# Altium schematic sheet NeopixelArray.SchDoc: Neopixel array
size A4
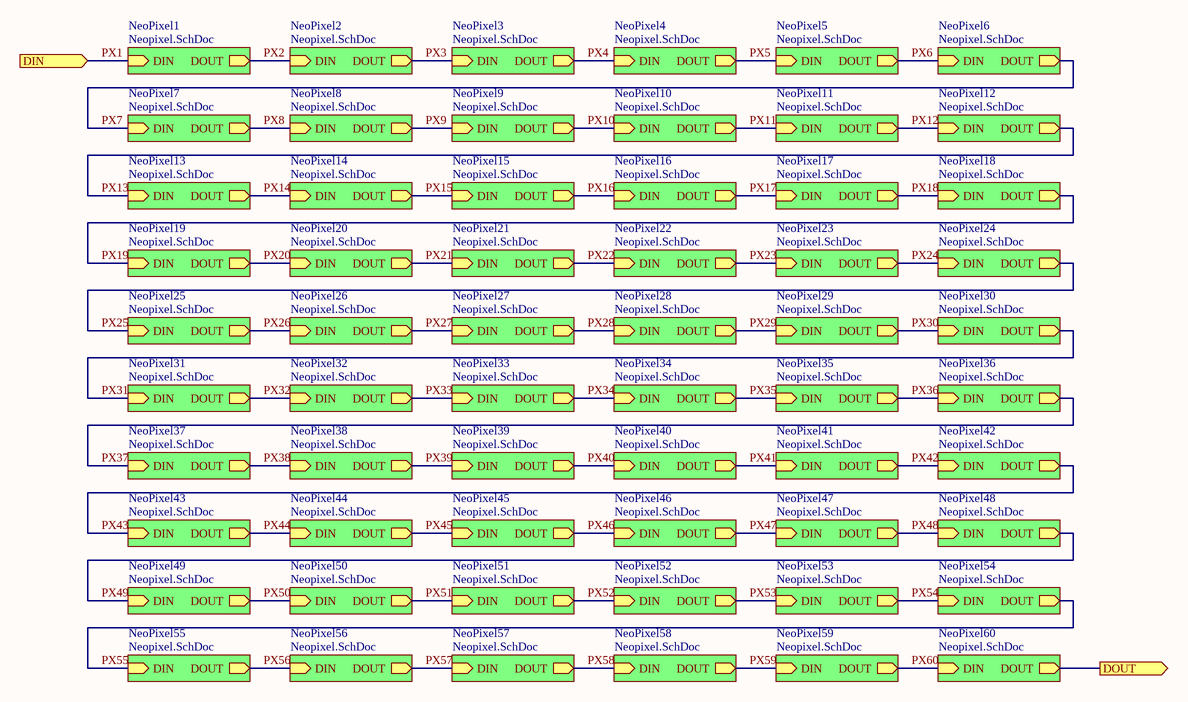
[diagram p0: NeopixelArray.SchDoc]

## Sub-sheets
NeoPixel1 = Neopixel.SchDoc: DIN (in), DOUT (out)
NeoPixel2 = Neopixel.SchDoc: DIN (in), DOUT (out)
NeoPixel3 = Neopixel.SchDoc: DIN (in), DOUT (out)
NeoPixel4 = Neopixel.SchDoc: DIN (in), DOUT (out)
NeoPixel5 = Neopixel.SchDoc: DIN (in), DOUT (out)
NeoPixel6 = Neopixel.SchDoc: DIN (in), DOUT (out)
NeoPixel7 = Neopixel.SchDoc: DIN (in), DOUT (out)
NeoPixel8 = Neopixel.SchDoc: DIN (in), DOUT (out)
NeoPixel9 = Neopixel.SchDoc: DIN (in), DOUT (out)
NeoPixel10 = Neopixel.SchDoc: DIN (in), DOUT (out)
NeoPixel11 = Neopixel.SchDoc: DIN (in), DOUT (out)
NeoPixel12 = Neopixel.SchDoc: DIN (in), DOUT (out)
NeoPixel13 = Neopixel.SchDoc: DIN (in), DOUT (out)
NeoPixel14 = Neopixel.SchDoc: DIN (in), DOUT (out)
NeoPixel15 = Neopixel.SchDoc: DIN (in), DOUT (out)
NeoPixel16 = Neopixel.SchDoc: DIN (in), DOUT (out)
NeoPixel17 = Neopixel.SchDoc: DIN (in), DOUT (out)
NeoPixel18 = Neopixel.SchDoc: DIN (in), DOUT (out)
NeoPixel19 = Neopixel.SchDoc: DIN (in), DOUT (out)
NeoPixel20 = Neopixel.SchDoc: DIN (in), DOUT (out)
NeoPixel21 = Neopixel.SchDoc: DIN (in), DOUT (out)
NeoPixel22 = Neopixel.SchDoc: DIN (in), DOUT (out)
NeoPixel23 = Neopixel.SchDoc: DIN (in), DOUT (out)
NeoPixel24 = Neopixel.SchDoc: DIN (in), DOUT (out)
NeoPixel25 = Neopixel.SchDoc: DIN (in), DOUT (out)
NeoPixel26 = Neopixel.SchDoc: DIN (in), DOUT (out)
NeoPixel27 = Neopixel.SchDoc: DIN (in), DOUT (out)
NeoPixel28 = Neopixel.SchDoc: DIN (in), DOUT (out)
NeoPixel29 = Neopixel.SchDoc: DIN (in), DOUT (out)
NeoPixel30 = Neopixel.SchDoc: DIN (in), DOUT (out)
NeoPixel31 = Neopixel.SchDoc: DIN (in), DOUT (out)
NeoPixel32 = Neopixel.SchDoc: DIN (in), DOUT (out)
NeoPixel33 = Neopixel.SchDoc: DIN (in), DOUT (out)
NeoPixel34 = Neopixel.SchDoc: DIN (in), DOUT (out)
NeoPixel35 = Neopixel.SchDoc: DIN (in), DOUT (out)
NeoPixel36 = Neopixel.SchDoc: DIN (in), DOUT (out)
NeoPixel37 = Neopixel.SchDoc: DIN (in), DOUT (out)
NeoPixel38 = Neopixel.SchDoc: DIN (in), DOUT (out)
NeoPixel39 = Neopixel.SchDoc: DIN (in), DOUT (out)
NeoPixel40 = Neopixel.SchDoc: DIN (in), DOUT (out)
NeoPixel41 = Neopixel.SchDoc: DIN (in), DOUT (out)
NeoPixel42 = Neopixel.SchDoc: DIN (in), DOUT (out)
NeoPixel43 = Neopixel.SchDoc: DIN (in), DOUT (out)
NeoPixel44 = Neopixel.SchDoc: DIN (in), DOUT (out)
NeoPixel45 = Neopixel.SchDoc: DIN (in), DOUT (out)
NeoPixel46 = Neopixel.SchDoc: DIN (in), DOUT (out)
NeoPixel47 = Neopixel.SchDoc: DIN (in), DOUT (out)
NeoPixel48 = Neopixel.SchDoc: DIN (in), DOUT (out)
NeoPixel49 = Neopixel.SchDoc: DIN (in), DOUT (out)
NeoPixel50 = Neopixel.SchDoc: DIN (in), DOUT (out)
NeoPixel51 = Neopixel.SchDoc: DIN (in), DOUT (out)
NeoPixel52 = Neopixel.SchDoc: DIN (in), DOUT (out)
NeoPixel53 = Neopixel.SchDoc: DIN (in), DOUT (out)
NeoPixel54 = Neopixel.SchDoc: DIN (in), DOUT (out)
NeoPixel55 = Neopixel.SchDoc: DIN (in), DOUT (out)
NeoPixel56 = Neopixel.SchDoc: DIN (in), DOUT (out)
NeoPixel57 = Neopixel.SchDoc: DIN (in), DOUT (out)
NeoPixel58 = Neopixel.SchDoc: DIN (in), DOUT (out)
NeoPixel59 = Neopixel.SchDoc: DIN (in), DOUT (out)
NeoPixel60 = Neopixel.SchDoc: DIN (in), DOUT (out)

## Ports
DIN (in), DOUT (out)

## Nets
DOUT: port DOUT, sheet NeoPixel60/DOUT
PX1: port DIN, sheet NeoPixel1/DIN
PX2: sheet NeoPixel1/DOUT, sheet NeoPixel2/DIN
PX3: sheet NeoPixel2/DOUT, sheet NeoPixel3/DIN
PX4: sheet NeoPixel3/DOUT, sheet NeoPixel4/DIN
PX5: sheet NeoPixel4/DOUT, sheet NeoPixel5/DIN
PX6: sheet NeoPixel5/DOUT, sheet NeoPixel6/DIN
PX7: sheet NeoPixel6/DOUT, sheet NeoPixel7/DIN
PX8: sheet NeoPixel7/DOUT, sheet NeoPixel8/DIN
PX9: sheet NeoPixel8/DOUT, sheet NeoPixel9/DIN
PX10: sheet NeoPixel9/DOUT, sheet NeoPixel10/DIN
PX11: sheet NeoPixel10/DOUT, sheet NeoPixel11/DIN
PX12: sheet NeoPixel11/DOUT, sheet NeoPixel12/DIN
PX13: sheet NeoPixel12/DOUT, sheet NeoPixel13/DIN
PX14: sheet NeoPixel13/DOUT, sheet NeoPixel14/DIN
PX15: sheet NeoPixel14/DOUT, sheet NeoPixel15/DIN
PX16: sheet NeoPixel15/DOUT, sheet NeoPixel16/DIN
PX17: sheet NeoPixel16/DOUT, sheet NeoPixel17/DIN
PX18: sheet NeoPixel17/DOUT, sheet NeoPixel18/DIN
PX19: sheet NeoPixel18/DOUT, sheet NeoPixel19/DIN
PX20: sheet NeoPixel19/DOUT, sheet NeoPixel20/DIN
PX21: sheet NeoPixel20/DOUT, sheet NeoPixel21/DIN
PX22: sheet NeoPixel21/DOUT, sheet NeoPixel22/DIN
PX23: sheet NeoPixel22/DOUT, sheet NeoPixel23/DIN
PX24: sheet NeoPixel23/DOUT, sheet NeoPixel24/DIN
PX25: sheet NeoPixel24/DOUT, sheet NeoPixel25/DIN
PX26: sheet NeoPixel25/DOUT, sheet NeoPixel26/DIN
PX27: sheet NeoPixel26/DOUT, sheet NeoPixel27/DIN
PX28: sheet NeoPixel27/DOUT, sheet NeoPixel28/DIN
PX29: sheet NeoPixel28/DOUT, sheet NeoPixel29/DIN
PX30: sheet NeoPixel29/DOUT, sheet NeoPixel30/DIN
PX31: sheet NeoPixel30/DOUT, sheet NeoPixel31/DIN
PX32: sheet NeoPixel31/DOUT, sheet NeoPixel32/DIN
PX33: sheet NeoPixel32/DOUT, sheet NeoPixel33/DIN
PX34: sheet NeoPixel33/DOUT, sheet NeoPixel34/DIN
PX35: sheet NeoPixel34/DOUT, sheet NeoPixel35/DIN
PX36: sheet NeoPixel35/DOUT, sheet NeoPixel36/DIN
PX37: sheet NeoPixel36/DOUT, sheet NeoPixel37/DIN
PX38: sheet NeoPixel37/DOUT, sheet NeoPixel38/DIN
PX39: sheet NeoPixel38/DOUT, sheet NeoPixel39/DIN
PX40: sheet NeoPixel39/DOUT, sheet NeoPixel40/DIN
PX41: sheet NeoPixel40/DOUT, sheet NeoPixel41/DIN
PX42: sheet NeoPixel41/DOUT, sheet NeoPixel42/DIN
PX43: sheet NeoPixel42/DOUT, sheet NeoPixel43/DIN
PX44: sheet NeoPixel43/DOUT, sheet NeoPixel44/DIN
PX45: sheet NeoPixel44/DOUT, sheet NeoPixel45/DIN
PX46: sheet NeoPixel45/DOUT, sheet NeoPixel46/DIN
PX47: sheet NeoPixel46/DOUT, sheet NeoPixel47/DIN
PX48: sheet NeoPixel47/DOUT, sheet NeoPixel48/DIN
PX49: sheet NeoPixel48/DOUT, sheet NeoPixel49/DIN
PX50: sheet NeoPixel49/DOUT, sheet NeoPixel50/DIN
PX51: sheet NeoPixel50/DOUT, sheet NeoPixel51/DIN
PX52: sheet NeoPixel51/DOUT, sheet NeoPixel52/DIN
PX53: sheet NeoPixel52/DOUT, sheet NeoPixel53/DIN
PX54: sheet NeoPixel53/DOUT, sheet NeoPixel54/DIN
PX55: sheet NeoPixel54/DOUT, sheet NeoPixel55/DIN
PX56: sheet NeoPixel55/DOUT, sheet NeoPixel56/DIN
PX57: sheet NeoPixel56/DOUT, sheet NeoPixel57/DIN
PX58: sheet NeoPixel57/DOUT, sheet NeoPixel58/DIN
PX59: sheet NeoPixel58/DOUT, sheet NeoPixel59/DIN
PX60: sheet NeoPixel59/DOUT, sheet NeoPixel60/DIN

## Notes on the sheet
- Title
- Size:
- Date:
- A4
- Number:
- Time:
- Revision:
- Sheet
- of
- File: